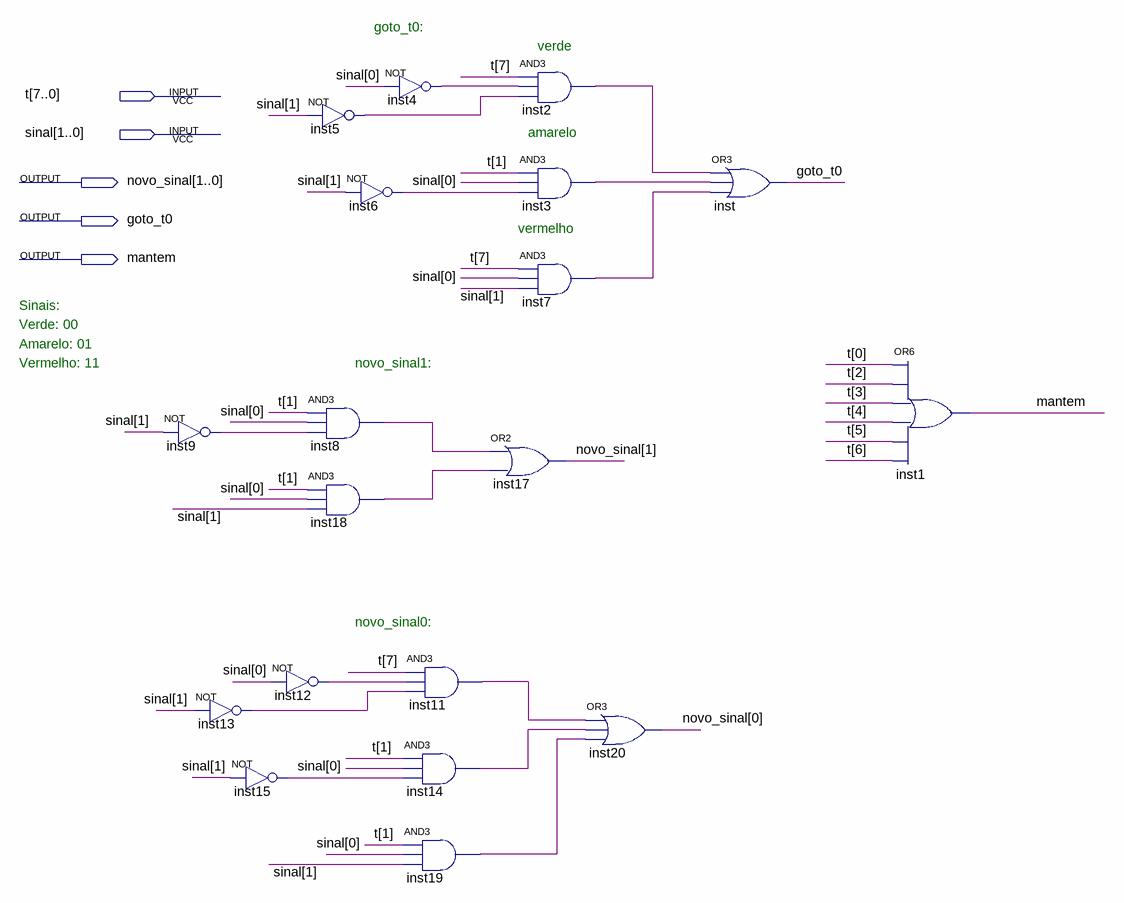
[diagram p0: schematic sheet]
// Quartus schematic LogicaDeEstados.bdf as structural Verilog: 19 symbols, 5 pins
module LogicaDeEstados (
  input  [7:0] t,
  input  [1:0] sinal,
  output [1:0] novo_sinal,
  output goto_t0,
  output mantem
);

  wire inst2_out, inst3_out, inst4_out, inst5_out, inst6_out, inst7_out, inst8_out, inst9_out, inst11_out,
       inst12_out, inst13_out, inst14_out, inst15_out, inst18_out, inst19_out;

  not inst9 (inst9_out, sinal[1]);
  not inst13 (inst13_out, sinal[1]);
  not inst12 (inst12_out, sinal[0]);
  not inst15 (inst15_out, sinal[1]);
  not inst5 (inst5_out, sinal[1]);
  not inst6 (inst6_out, sinal[1]);
  and inst8 (inst8_out, t[1], sinal[0], inst9_out);
  and inst18 (inst18_out, t[1], sinal[0], sinal[1]);
  not inst4 (inst4_out, sinal[0]);
  and inst11 (inst11_out, t[7], inst12_out, inst13_out);
  and inst14 (inst14_out, t[1], sinal[0], inst15_out);
  and inst19 (inst19_out, t[1], sinal[0], sinal[1]);
  or inst17 (novo_sinal[1], inst8_out, inst18_out);
  and inst2 (inst2_out, t[7], inst4_out, inst5_out);
  and inst3 (inst3_out, t[1], sinal[0], inst6_out);
  and inst7 (inst7_out, t[7], sinal[0], sinal[1]);
  or inst20 (novo_sinal[0], inst11_out, inst14_out, inst19_out);
  or inst (goto_t0, inst2_out, inst3_out, inst7_out);
  or inst1 (mantem, t[0], t[2], t[3], t[4], t[5], t[6]);

  // Notes on the sheet:
  //   goto_t0:
  //   verde
  //   amarelo
  //   vermelho
  //   Sinais:
  //   Verde: 00
  //   Amarelo: 01
  //   Vermelho: 11
  //   novo_sinal1:
  //   novo_sinal0:
endmodule
